# Altium project PiPo.PrjPcb
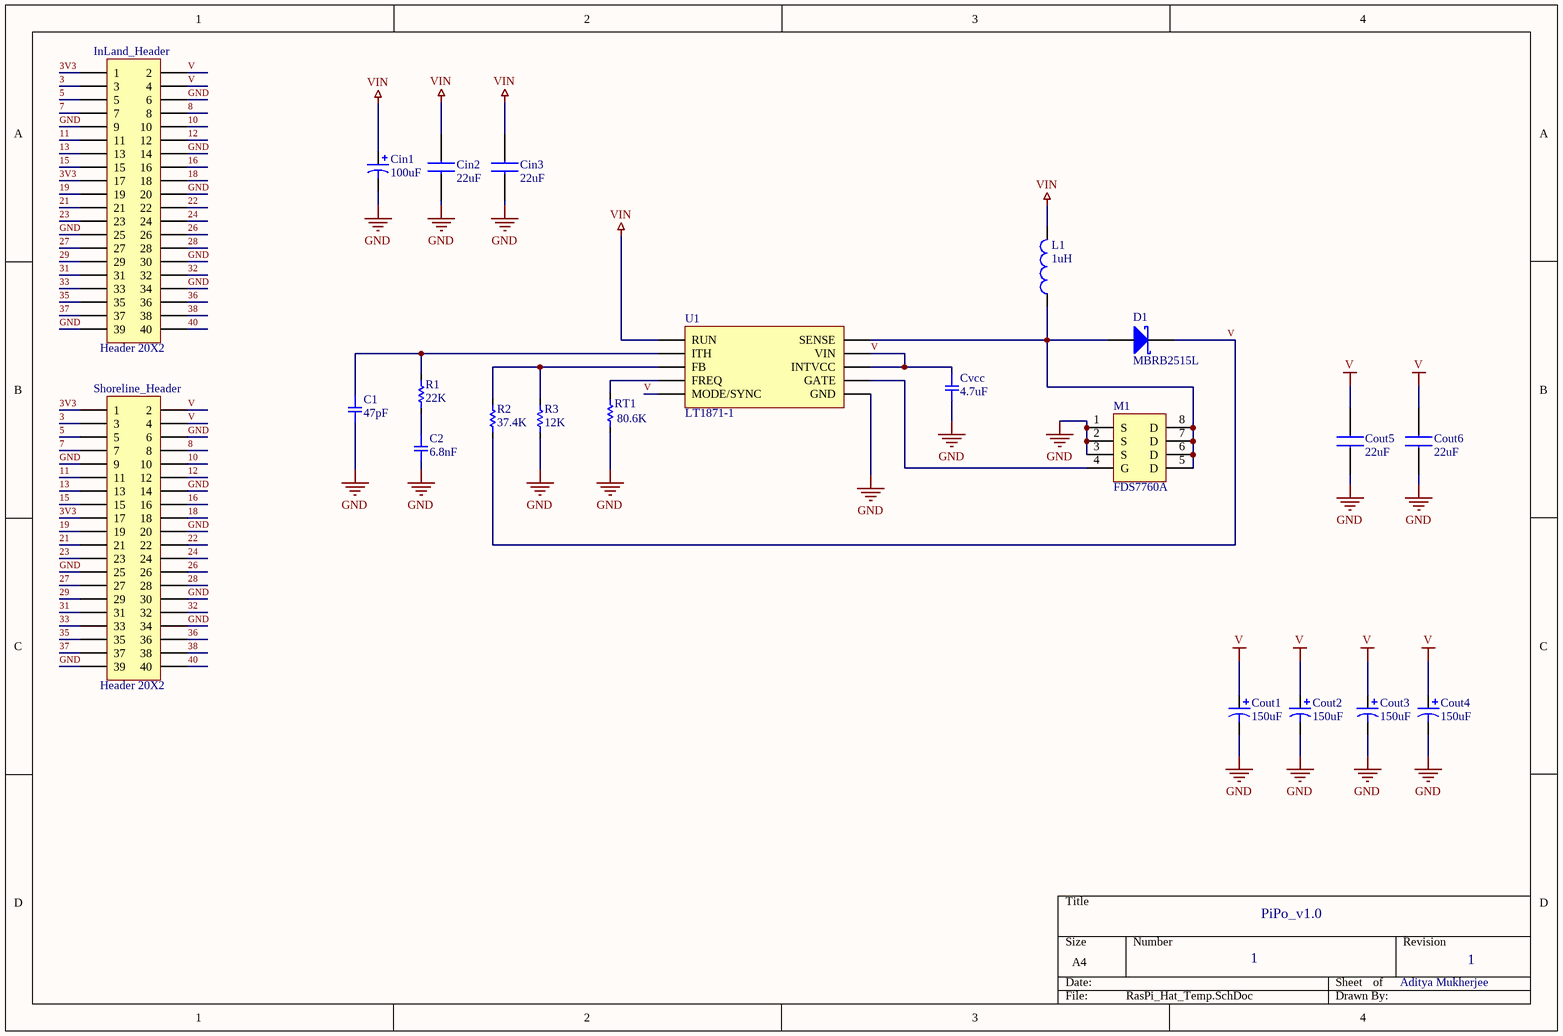
[diagram p0: RasPi_Hat_Temp.SchDoc]
1 sheet, 22 parts. Net scope: global (net labels, ports and power ports of the same name join across sheets).
Board file: RasPi_Hat_Temp.PcbDoc

## Sheet RasPi_Hat_Temp.SchDoc
size A4

### Parts
C1  47pF  [SMD-0805C]
C2  6.8nF  [SMD-0603C]
Cin1  100uF  [TPSA226K006T0300]
Cin2  22uF  [PCBComponent_1]
Cin3  22uF  [PCBComponent_1]
Cout1  150uF  [EEF-CX0J151R]
Cout2  150uF  [EEF-CX0J151R]
Cout3  150uF  [EEF-CX0J151R]
Cout4  150uF  [EEF-CX0J151R]
Cout5  22uF  [PCBComponent_1]
Cout6  22uF  [PCBComponent_1]
Cvcc  4.7uF  [SMD-0805C]
D1  MBRB2515L  [MBRB2515L]
InLand_Header  Header 20X2  [HDR2X20]
L1  1uH  [PCBComponent_1]
M1  FDS7760A  [FDS7760A]
R1  22K  [Resistor_0805]
R2  37.4K  [Resistor_0805]
R3  12K  [Resistor_0805]
RT1  80.6K  [Resistor_0805]
Shoreline_Header  Header 20X2  [HDR2X20]
U1  LT1871-1  [LTC1871-1]

### Nets
GND: C1.2 C2.2 Cin1.2 Cin2.1 Cin3.1 Cout1.1 Cout2.1 Cout3.1 Cout4.1 Cout5.1 Cout6.1 Cvcc.2 InLand_Header.6 InLand_Header.9 InLand_Header.14 InLand_Header.20 InLand_Header.25 InLand_Header.30 InLand_Header.34 InLand_Header.39 M1.1(S) M1.2(S) M1.3(S) R3.1 RT1.1 Shoreline_Header.6 Shoreline_Header.9 Shoreline_Header.14 Shoreline_Header.20 Shoreline_Header.25 Shoreline_Header.30 Shoreline_Header.34 Shoreline_Header.39 U1.6(GND)
V: Cout1.2 Cout2.2 Cout3.2 Cout4.2 Cout5.2 Cout6.2 Cvcc.1 D1.4(K) InLand_Header.2 InLand_Header.4 R2.1 Shoreline_Header.2 Shoreline_Header.4 U1.5(MODE/SYNC) U1.8(INTVCC) U1.9(VIN)
VIN: Cin1.1 Cin2.2 Cin3.2 L1.2 U1.1(RUN)
3: InLand_Header.3 Shoreline_Header.3
3V3: InLand_Header.1 InLand_Header.17 Shoreline_Header.1 Shoreline_Header.17
5: InLand_Header.5 Shoreline_Header.5
7: InLand_Header.7 Shoreline_Header.7
8: InLand_Header.8 Shoreline_Header.8
10: InLand_Header.10 Shoreline_Header.10
11: InLand_Header.11 Shoreline_Header.11
12: InLand_Header.12 Shoreline_Header.12
13: InLand_Header.13 Shoreline_Header.13
15: InLand_Header.15 Shoreline_Header.15
16: InLand_Header.16 Shoreline_Header.16
18: InLand_Header.18 Shoreline_Header.18
19: InLand_Header.19 Shoreline_Header.19
21: InLand_Header.21 Shoreline_Header.21
22: InLand_Header.22 Shoreline_Header.22
23: InLand_Header.23 Shoreline_Header.23
24: InLand_Header.24 Shoreline_Header.24
26: InLand_Header.26 Shoreline_Header.26
27: InLand_Header.27 Shoreline_Header.27
28: InLand_Header.28 Shoreline_Header.28
29: InLand_Header.29 Shoreline_Header.29
31: InLand_Header.31 Shoreline_Header.31
32: InLand_Header.32 Shoreline_Header.32
33: InLand_Header.33 Shoreline_Header.33
35: InLand_Header.35 Shoreline_Header.35
36: InLand_Header.36 Shoreline_Header.36
37: InLand_Header.37 Shoreline_Header.37
38: InLand_Header.38 Shoreline_Header.38
40: InLand_Header.40 Shoreline_Header.40
NetC1_1: C1.1 R1.2 U1.2(ITH)
NetC2_1: C2.1 R1.1
NetD1_3: D1.3(A) L1.1 M1.5(D) M1.6(D) M1.7(D) M1.8(D) U1.10(SENSE)
NetM1_4: M1.4(G) U1.7(GATE)
NetR2_2: R2.2 R3.2 U1.3(FB)
NetRT1_2: RT1.2 U1.4(FREQ)

### Notes on the sheet
- PiPo_v1.0
- 1
- Aditya Mukherjee

### Library data of the parts
C1 = GC321AD72E103KX01D: CAP CER 10000PF 250V X7T 0805; Manufacturer: Murata Electronics North America; Factory Stock: 0; Unit Price (USD): 0.3; Minimum Quantity: 1; Tolerance: ±10%; Datasheets: http://search.murata.co.jp/Ceramy/image/img/A01X/G101/ENG/GC321AD72E103KX01-01.pdf; Image: //media.digikey.com/Renders/Murata%20Renders/0805(GC3)200x125.jpg; Digi-Key Part Number: 490-13986-1-ND; Part Number: GC321AD72E103KX01D; Quantity Available: 4000; @ qty: 0; Packaging: Cut Tape (CT); Series: GC3; Part Status: Active; Value: 47pF; Voltage: 250V; Temperature Coefficient: X7T; Operating Temperature: -55°C ~ 125°C; Features: -; Ratings: AEC-Q200; Applications: Automotive; Mounting Type: Surface Mount, MLCC; Package / Case: 0805 (2012 Metric); Size / Dimension: 0.079" L x 0.049" W (2.00mm x 1.25mm); Height - Seated (Max): -; Thickness (Max): 0.039" (1.00mm); Lead Spacing: -; Lead Style: -
C2 = GCJ188R71C104KA01D: CAP CER 0.1UF 16V X7R 0603; Manufacturer: Murata Electronics North America; Factory Stock: 0; Unit Price (USD): 0.21; Minimum Quantity: 1; Tolerance: ±10%; Datasheets: http://www.murata.com/~/media/webrenewal/support/library/catalog/products/capacitor/mlcc/c03e.ashx; Image: //media.digikey.com/Renders/Murata%20Renders/0603%28LQG18%29.jpg; Digi-Key Part Number: 490-5796-1-ND; Part Number: GCJ188R71C104KA01D; Quantity Available: 22473; @ qty: 0; Packaging: Cut Tape (CT); Series: GCJ; Part Status: Active; Value: 6.8nF; Voltage: 16V; Temperature Coefficient: X7R; Operating Temperature: -55°C ~ 125°C; Features: Soft Termination; Ratings: AEC-Q200; Applications: Automotive, Boardflex Sensitive; Mounting Type: Surface Mount, MLCC; Package / Case: 0603 (1608 Metric); Size / Dimension: 0.063" L x 0.031" W (1.60mm x 0.80mm); Height - Seated (Max): -; Thickness (Max): 0.035" (0.90mm); Lead Spacing: -; Lead Style: -
Cin1 = Component_1: 1206_TANTALUM; VALUE: 100uF
Cin2 Cin3 Cout1-Cout6 D1 L1 M1 R1-R3 RT1 U1 = Component_1
  Cin2 Cin3 Cout5 Cout6: VALUE: 22uF
  Cout1-Cout4: VALUE: 150uF
  L1: VALUE: 1uH
  R1: VALUE: 22K
  R2: VALUE: 37.4K
  R3: VALUE: 12K
  RT1: VALUE: 80.6K
Cvcc = GC321AD72E103KX01D: CAP CER 10000PF 250V X5R 0805; Manufacturer: Murata Electronics North America; Factory Stock: 0; Unit Price (USD): 0.3; Minimum Quantity: 1; Tolerance: ±10%; Datasheets: http://search.murata.co.jp/Ceramy/image/img/A01X/G101/ENG/GC321AD72E103KX01-01.pdf; Image: //media.digikey.com/Renders/Murata%20Renders/0805(GC3)200x125.jpg; Digi-Key Part Number: 490-13986-1-ND; Part Number: GC321AD72E103KX01D; Quantity Available: 4000; @ qty: 0; Packaging: Cut Tape (CT); Series: GC3; Part Status: Active; Value: 4.7uF; Voltage: 250V; Temperature Coefficient: X5R; Operating Temperature: -55°C ~ 125°C; Features: -; Ratings: AEC-Q200; Applications: Automotive; Mounting Type: Surface Mount, MLCC; Package / Case: 0805 (2012 Metric); Size / Dimension: 0.079" L x 0.049" W (2.00mm x 1.25mm); Height - Seated (Max): -; Thickness (Max): 0.039" (1.00mm); Lead Spacing: -; Lead Style: -
InLand_Header Shoreline_Header = Header 20X2: Header, 20-Pin, Dual row; LatestRevisionDate: 17-Jul-2002; LatestRevisionNote: Re-released for DXP Platform.; Publisher: Altium Limited